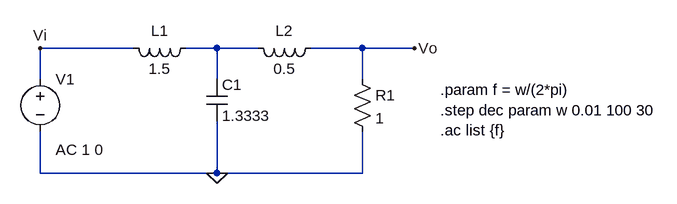
[diagram p0: schematic circuito.asc]
circuito.asc, the LTspice schematic file:
Version 4
SHEET 1 880 680
WIRE 48 96 -96 96
WIRE 176 96 128 96
WIRE 240 96 176 96
WIRE 400 96 320 96
WIRE 480 96 400 96
WIRE -96 144 -96 96
WIRE 176 144 176 96
WIRE 400 144 400 96
WIRE -96 288 -96 224
WIRE 176 288 176 208
WIRE 176 288 -96 288
WIRE 400 288 400 224
WIRE 400 288 176 288
FLAG 480 96 Vo
FLAG -96 96 Vi
FLAG 176 288 0
SYMBOL ind 144 80 R90
WINDOW 0 5 56 VBottom 2
WINDOW 3 32 56 VTop 2
SYMATTR InstName L1
SYMATTR Value 1.5
SYMBOL ind 336 80 R90
WINDOW 0 5 56 VBottom 2
WINDOW 3 32 56 VTop 2
SYMATTR InstName L2
SYMATTR Value 0.5
SYMBOL cap 160 144 R0
SYMATTR InstName C1
SYMATTR Value 1.3333
SYMBOL res 384 128 R0
SYMATTR InstName R1
SYMATTR Value 1
SYMBOL voltage -96 128 R0
WINDOW 123 24 124 Left 2
WINDOW 39 0 0 Left 0
SYMATTR InstName V1
SYMATTR Value ""
SYMATTR Value2 AC 1 0
TEXT 520 160 Left 2 !.param f = w/(2*pi)\n.step dec param w 0.01 100 30\n.ac list {f}

The netlist it stands for:
* circuito.asc
L1 N001 Vi 1.5
L2 Vo N001 0.5
C1 N001 0 1.3333
R1 Vo 0 1
V1 Vi 0 AC 1 0
.param f = w/(2*pi)
.step dec param w 0.01 100 30
.ac list {f}
.backanno
.end